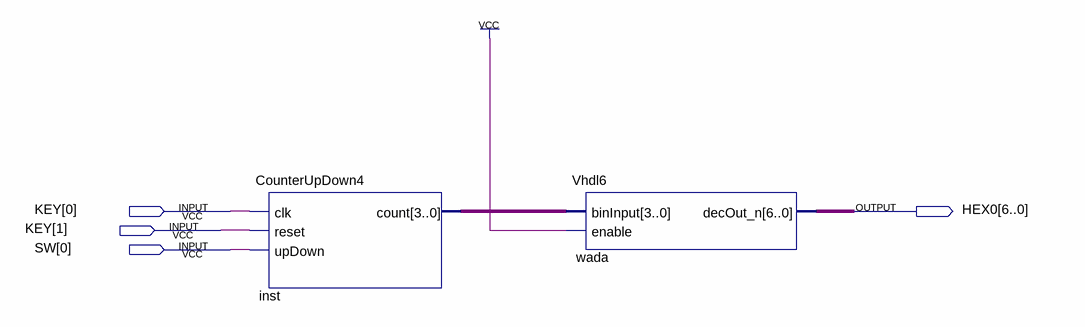
[diagram p0: schematic sheet]
// Quartus schematic Counter_Demo.bdf as structural Verilog: 2 symbols, 4 pins
module Counter_Demo (
  input  [1:0] KEY,
  input  [0:0] SW,
  output [6:0] HEX0
);

  wire [3:0] inst_count;

  CounterUpDown4 inst (.clk(KEY[0]), .reset(KEY[1]), .upDown(SW[0]), .count(inst_count));
  Vhdl6 wada (.binInput(inst_count), .enable(1'b1), .decOut_n(HEX0));
endmodule
